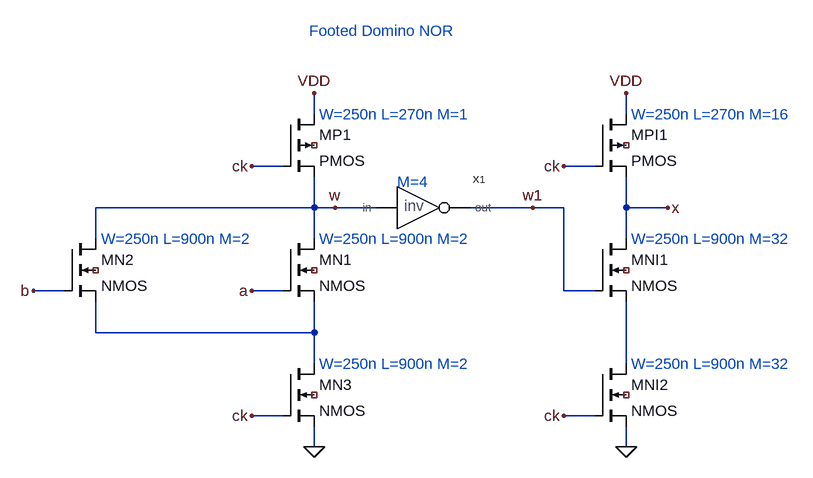
[diagram p0: schematic FD_NOR.asc]
FD_NOR.asc, the LTspice schematic file:
Version 4
SHEET 1 1140 680
WIRE 208 -128 208 -160
WIRE 688 -128 688 -160
WIRE 160 -48 112 -48
WIRE 640 -48 592 -48
WIRE 208 16 208 -32
WIRE 208 16 -128 16
WIRE 240 16 208 16
WIRE 304 16 240 16
WIRE 544 16 448 16
WIRE 592 16 544 16
WIRE 688 16 688 -32
WIRE 752 16 688 16
WIRE -128 64 -128 16
WIRE 208 64 208 16
WIRE 688 64 688 16
WIRE -176 144 -224 144
WIRE 160 144 112 144
WIRE 592 144 592 16
WIRE 640 144 592 144
WIRE -128 208 -128 160
WIRE 208 208 208 160
WIRE 208 208 -128 208
WIRE 208 256 208 208
WIRE 688 256 688 160
WIRE 160 336 112 336
WIRE 640 336 592 336
WIRE 208 384 208 352
WIRE 688 384 688 352
FLAG 112 -48 ck
FLAG 112 144 a
FLAG -224 144 b
FLAG 208 -160 VDD
FLAG 112 336 ck
FLAG 208 384 0
FLAG 240 16 w
FLAG 544 16 w1
FLAG 688 384 0
FLAG 592 336 ck
FLAG 592 -48 ck
FLAG 688 -160 VDD
FLAG 752 16 x
SYMBOL nmos4 -176 64 R0
SYMATTR InstName MN2
SYMBOL nmos4 160 64 R0
SYMATTR InstName MN1
SYMBOL pmos4 160 -128 R0
SYMATTR InstName MP1
SYMBOL nmos4 160 256 R0
SYMATTR InstName MN3
SYMBOL inv 400 16 R0
SYMATTR InstName X1
SYMBOL pmos4 640 -128 R0
SYMATTR InstName MPI1
SYMBOL nmos4 640 64 R0
SYMATTR InstName MNI1
SYMBOL nmos4 640 256 R0
SYMATTR InstName MNI2
TEXT 200 -256 Left 2 ;Footed Domino NOR
TEXT 216 -128 Left 2 ;W=250n L=270n M=1
TEXT 216 64 Left 2 ;W=250n L=900n M=2
TEXT -120 64 Left 2 ;W=250n L=900n M=2
TEXT 216 256 Left 2 ;W=250n L=900n M=2
TEXT 336 -24 Left 2 ;M=4
TEXT 696 -128 Left 2 ;W=250n L=270n M=16
TEXT 696 64 Left 2 ;W=250n L=900n M=32
TEXT 696 256 Left 2 ;W=250n L=900n M=32

The netlist it stands for:
* FD_NOR.asc
MN2 w b N001 NC_01 NMOS
MN1 w a N001 NC_02 NMOS
MP1 VDD ck w NC_03 PMOS
MN3 N001 ck 0 NC_04 NMOS
XX1 w w1 inv  ; pins in out
MPI1 VDD ck x NC_05 PMOS
MNI1 x w1 N002 NC_06 NMOS
MNI2 N002 ck 0 NC_07 NMOS
.model NMOS NMOS
.model PMOS PMOS
.lib standard.mos
* Footed Domino NOR
* W=250n L=270n M=1
* W=250n L=900n M=2
* W=250n L=900n M=2
* W=250n L=900n M=2
* M=4
* W=250n L=270n M=16
* W=250n L=900n M=32
* W=250n L=900n M=32
.backanno
.end